# EAGLE design microcpu-1line-try1 (EAGLE 9.6.2)

## Sheet 1 of 2
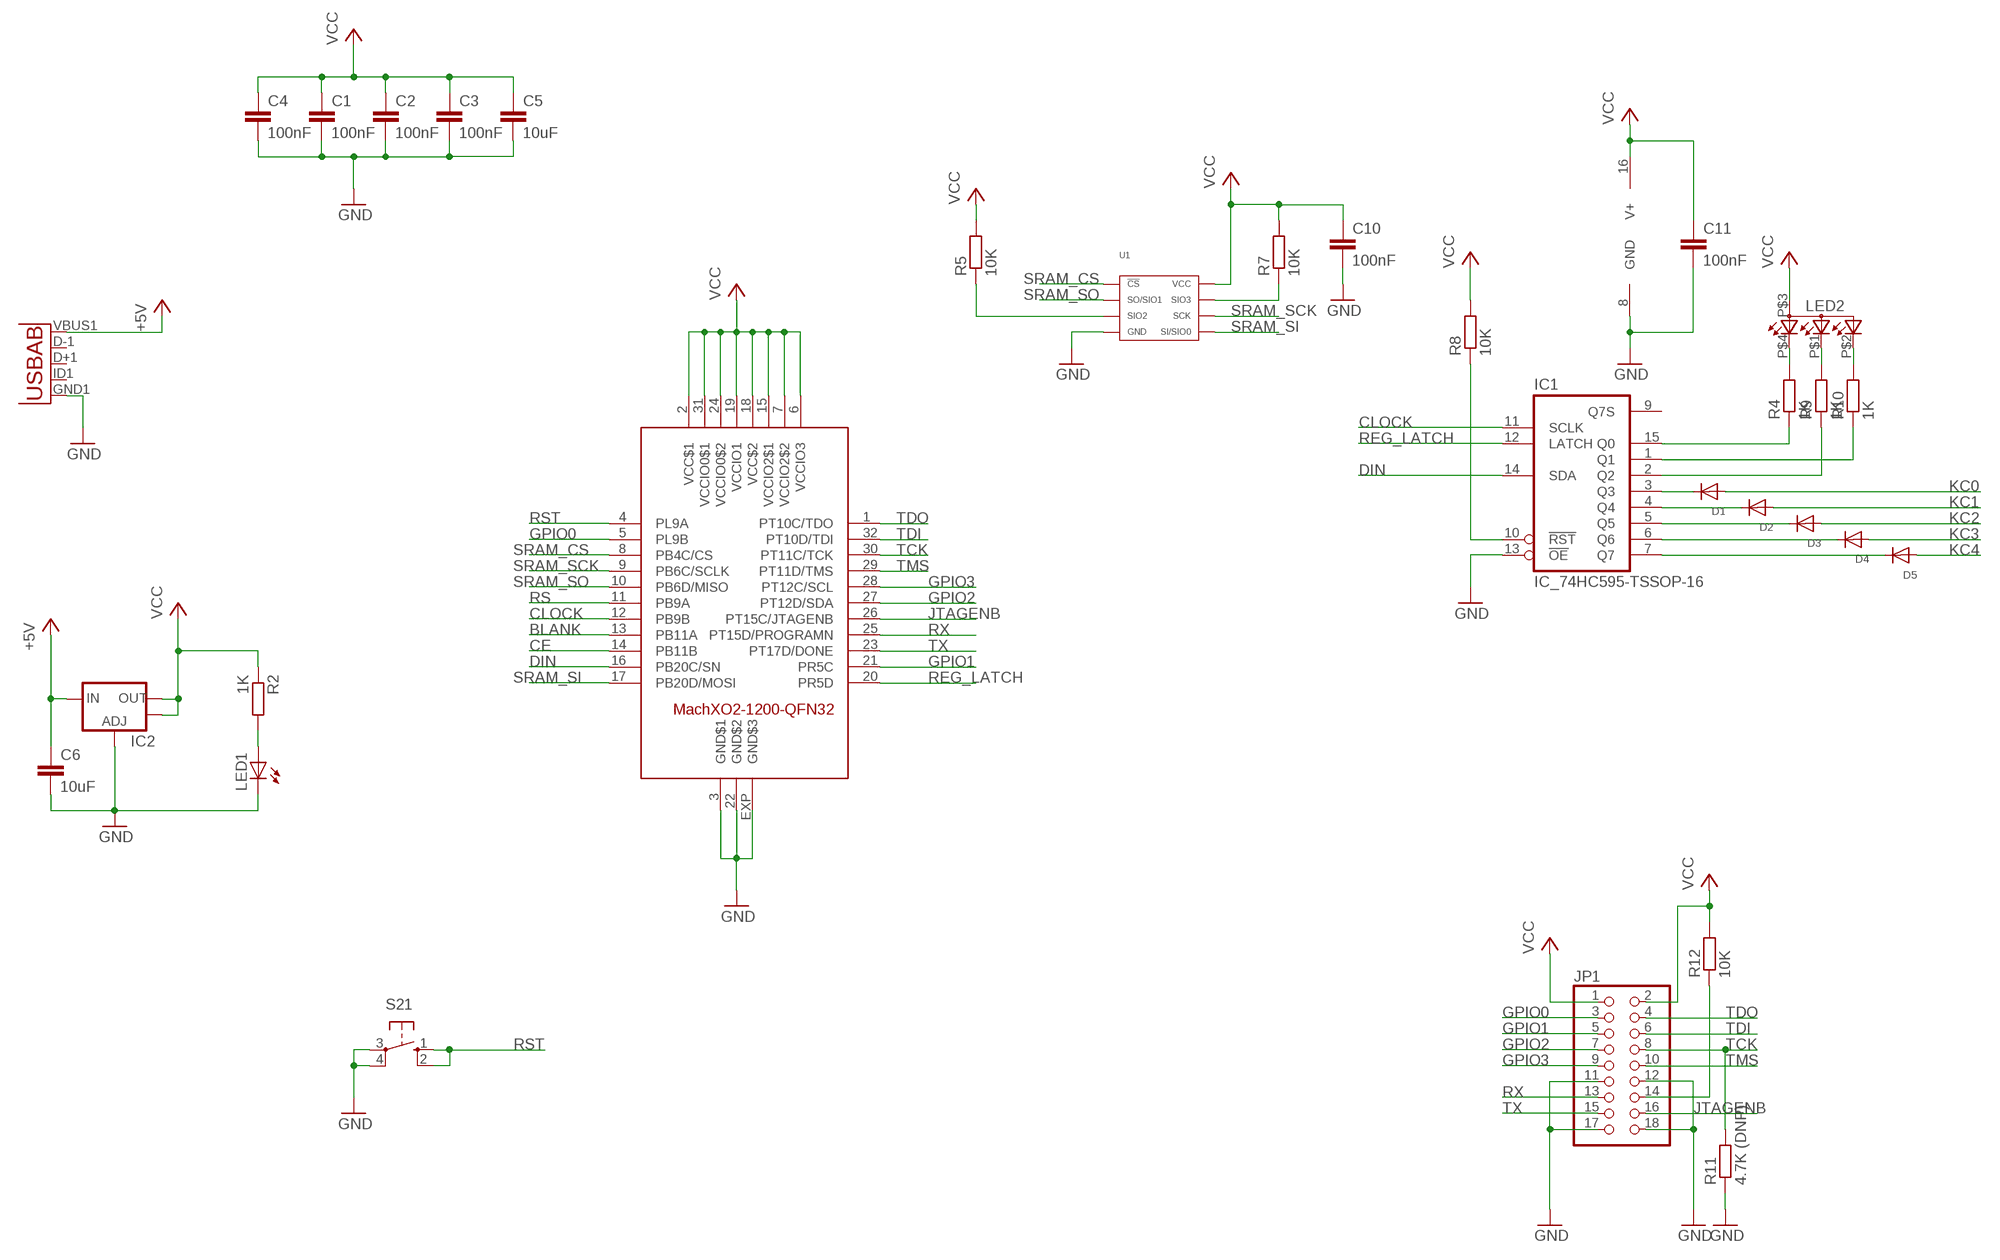
[diagram p0: schematic, sheet 1]

### Parts
C1  100nF  C-EUC0603  [C0603]
C2  100nF  C-EUC0603  [C0603]
C3  100nF  C-EUC0603  [C0603]
C4  100nF  C-EUC0603  [C0603]
C5  10uF  C-EUC0805  [C0805]
C6  10uF  C-EUC0805  [C0805]
C10  100nF  C-EUC0603  [C0603]
C11  100nF  C-EUC0603  [C0603]
D1  DIODESOD-123  [SOD-123]
D2  DIODESOD-123  [SOD-123]
D3  DIODESOD-123  [SOD-123]
D4  DIODESOD-123  [SOD-123]
D5  DIODESOD-123  [SOD-123]
IC1  IC_74HC595-TSSOP-16  [TSSOP-16]
IC2  V_REG_LM1117SOT223  [SOT223]
JP1  PINHD-2X9/90  [2X09/90]
LED1  LEDCHIPLED_0603  [CHIPLED_0603]
LED2  19-237/R6GHBHC-A04/2T  [19-237/R6GHBHC-A04/2T]
R2  1K  R-EU_R0603  [R0603]
R4  1K  R-EU_R0603  [R0603]
R5  10K  R-EU_R0603  [R0603]
R7  10K  R-EU_R0603  [R0603]
R8  10K  R-EU_R0603  [R0603]
R9  1K  R-EU_R0603  [R0603]
R10  1K  R-EU_R0603  [R0603]
R11  4.7K (DNP)  R-EU_R0603  [R0603]
R12  10K  R-EU_R0603  [R0603]
S21  10-XX  [B3F-10XX]
U1  23A1024/23LC1024-I/SN  [23A1024_SOIC-8]
U2  USB""  [USB-MICRO-SMD]
U$1  MACHXO2-1200  [QFN32]

### Nets
+5V: C6.1 IC2.3(IN) U2.VBUS1(VBUS)
BLANK: U$1.13(PB11A) ; also sheet 2
CE: U$1.14(PB11B) ; also sheet 2
CLOCK: IC1.11(SCLK) U$1.12(PB9B) ; also sheet 2
DIN: IC1.14(SDA) U$1.16(PB20C/SN) ; also sheet 2
GND [POWER]: C1.2 C2.2 C3.2 C4.2 C5.2 C6.2 C10.2 C11.2 IC1.8(GND) IC1.13(!OE) IC2.1(ADJ) JP1.11 JP1.12 JP1.17 JP1.18 LED1.C R11.1 S21.3(P) S21.4(P1) U1.4(GND) U2.GND1(GND) U$1.3(GND$1) U$1.22(GND$2) U$1.EXP(GND$3) ; also sheet 2
GPIO0: JP1.3 U$1.5(PL9B)
GPIO1: JP1.5 U$1.21(PR5C)
GPIO2: JP1.7 U$1.27(PT12D/SDA)
GPIO3: JP1.9 U$1.28(PT12C/SCL)
JTAGENB: JP1.16 U$1.26(PT15C/JTAGENB)
KC0: D1.A ; also sheet 2
KC1: D2.A ; also sheet 2
KC2: D3.A ; also sheet 2
KC3: D4.A ; also sheet 2
KC4: D5.A ; also sheet 2
N$1: LED1.A R2.2
N$3: R7.1 U1.7(SIO3)
N$4: IC1.10(!RST) R8.1
N$5: R5.1 U1.3(SIO2)
N$6: LED2.P$4(CRED) R4.2
N$7: LED2.P$1(CBLUE) R9.2
N$8: LED2.P$2(CGREEN) R10.2
N$9: IC1.15(Q0) R4.1
N$10: IC1.1(Q1) R10.1
N$11: IC1.2(Q2) R9.1
N$12: JP1.14 R12.1
N$13: D1.C IC1.3(Q3)
N$14: D2.C IC1.4(Q4)
N$15: D3.C IC1.5(Q5)
N$16: D4.C IC1.6(Q6)
N$17: D5.C IC1.7(Q7)
REG_LATCH: IC1.12(LATCH) U$1.20(PR5D)
RS: U$1.11(PB9A) ; also sheet 2
RST: S21.1(S) S21.2(S1) U$1.4(PL9A)
RX: JP1.13 U$1.25(PT15D/PROGRAMN)
SRAM_CS: U1.1(CS') U$1.8(PB4C/CS)
SRAM_SCK: U1.6(SCK) U$1.9(PB6C/SCLK)
SRAM_SI: U1.5(SI/SIO0) U$1.17(PB20D/MOSI)
SRAM_SO: U1.2(SO/SIO1) U$1.10(PB6D/MISO)
TCK: JP1.8 R11.2 U$1.30(PT11C/TCK) ; also sheet 2
TDI: JP1.6 U$1.32(PT10D/TDI) ; also sheet 2
TDO: JP1.4 U$1.1(PT10C/TDO) ; also sheet 2
TMS: JP1.10 U$1.29(PT11D/TMS) ; also sheet 2
TX: JP1.15 U$1.23(PT17D/DONE)
VCC [POWER]: C1.1 C2.1 C3.1 C4.1 C5.1 C10.1 C11.1 IC1.16(V+) IC2.2(OUT) IC2.4(OUT) JP1.1 JP1.2 LED2.P$3(A) R2.1 R5.2 R7.2 R8.2 R12.2 U1.8(VCC) U$1.2(VCC$1) U$1.6(VCCIO3) U$1.7(VCCIO2$2) U$1.15(VCCIO2$1) U$1.18(VCC$2) U$1.19(VCCIO1) U$1.24(VCCIO0$2) U$1.31(VCCIO0$1) ; also sheet 2
Unconnected: IC1.9(Q7S) U2.D+1(D+) U2.D-1(D-) U2.ID1(USBID)

## Sheet 2 of 2
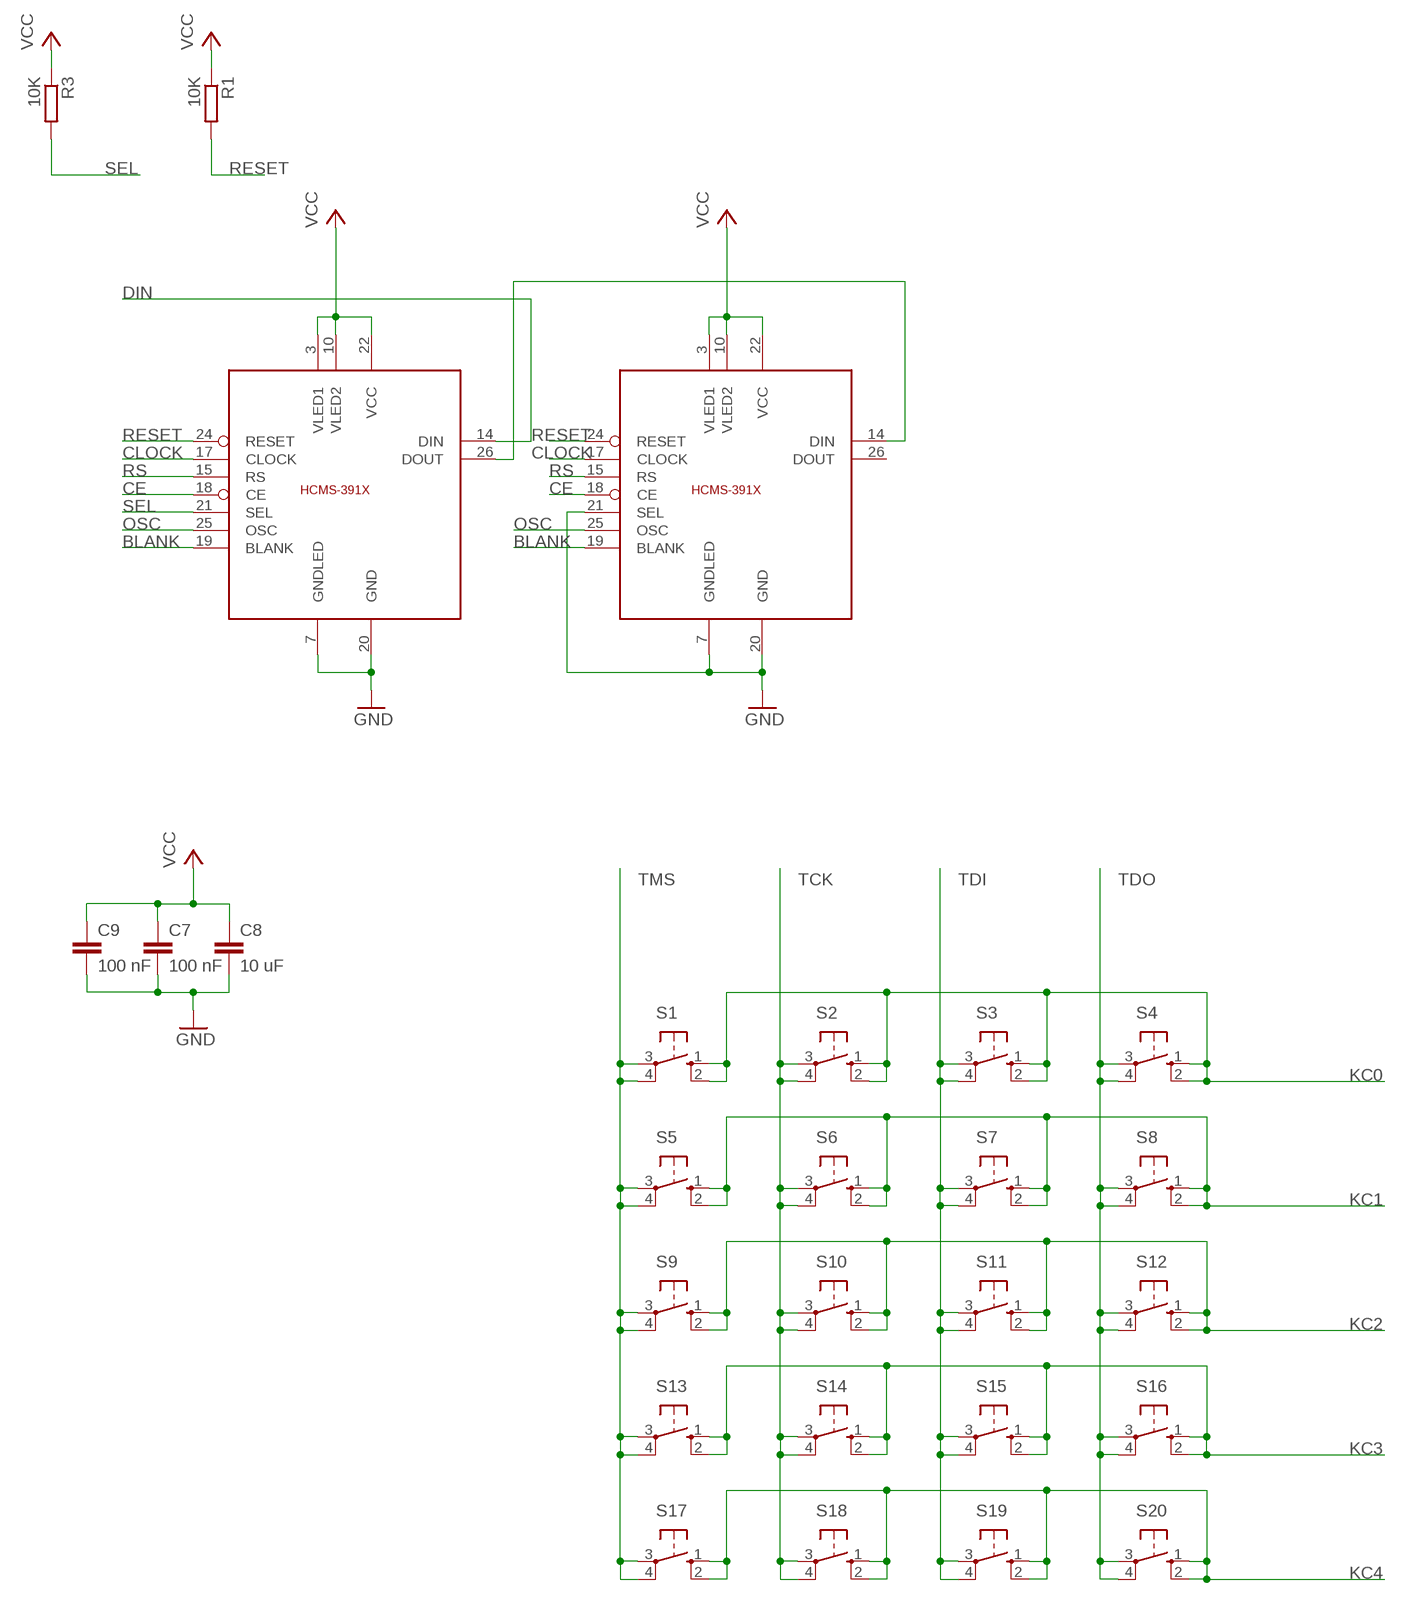
[diagram p1: schematic, sheet 2]

### Parts
C7  100 nF  C-EUC0603K  [C0603K]
C8  10 uF  C-EUC0805K  [C0805K]
C9  100 nF  C-EUC0603K  [C0603K]
R1  10K  R-EU_R0603  [R0603]
R3  10K  R-EU_R0603  [R0603]
S1  10-XX  [B3F-10XX]
S2  10-XX  [B3F-10XX]
S3  10-XX  [B3F-10XX]
S4  10-XX  [B3F-10XX]
S5  10-XX  [B3F-10XX]
S6  10-XX  [B3F-10XX]
S7  10-XX  [B3F-10XX]
S8  10-XX  [B3F-10XX]
S9  10-XX  [B3F-10XX]
S10  10-XX  [B3F-10XX]
S11  10-XX  [B3F-10XX]
S12  10-XX  [B3F-10XX]
S13  10-XX  [B3F-10XX]
S14  10-XX  [B3F-10XX]
S15  10-XX  [B3F-10XX]
S16  10-XX  [B3F-10XX]
S17  10-XX  [B3F-10XX]
S18  10-XX  [B3F-10XX]
S19  10-XX  [B3F-10XX]
S20  10-XX  [B3F-10XX]
U$2  HCMS-391X  [HCMS-391X]
U$3  HCMS-391X  [HCMS-391X]

### Nets
BLANK: U$2.19(BLANK) U$3.19(BLANK) ; also sheet 1
CE: U$2.18(CE) U$3.18(CE) ; also sheet 1
CLOCK: U$2.17(CLOCK) U$3.17(CLOCK) ; also sheet 1
DIN: U$2.14(DIN) ; also sheet 1
GND [POWER]: C7.2 C8.2 C9.2 U$2.7(GNDLED) U$2.20(GND) U$3.7(GNDLED) U$3.20(GND) U$3.21(SEL) ; also sheet 1
KC0: S1.1(S) S1.2(S1) S2.1(S) S2.2(S1) S3.1(S) S3.2(S1) S4.1(S) S4.2(S1) ; also sheet 1
KC1: S5.1(S) S5.2(S1) S6.1(S) S6.2(S1) S7.1(S) S7.2(S1) S8.1(S) S8.2(S1) ; also sheet 1
KC2: S9.1(S) S9.2(S1) S10.1(S) S10.2(S1) S11.1(S) S11.2(S1) S12.1(S) S12.2(S1) ; also sheet 1
KC3: S13.1(S) S13.2(S1) S14.1(S) S14.2(S1) S15.1(S) S15.2(S1) S16.1(S) S16.2(S1) ; also sheet 1
KC4: S17.1(S) S17.2(S1) S18.1(S) S18.2(S1) S19.1(S) S19.2(S1) S20.1(S) S20.2(S1) ; also sheet 1
N$2: U$2.26(DOUT) U$3.14(DIN)
OSC: U$2.25(OSC) U$3.25(OSC)
RESET: R1.2 U$2.24(RESET) U$3.24(RESET)
RS: U$2.15(RS) U$3.15(RS) ; also sheet 1
SEL: R3.2 U$2.21(SEL)
TCK: S2.3(P) S2.4(P1) S6.3(P) S6.4(P1) S10.3(P) S10.4(P1) S14.3(P) S14.4(P1) S18.3(P) S18.4(P1) ; also sheet 1
TDI: S3.3(P) S3.4(P1) S7.3(P) S7.4(P1) S11.3(P) S11.4(P1) S15.3(P) S15.4(P1) S19.3(P) S19.4(P1) ; also sheet 1
TDO: S4.3(P) S4.4(P1) S8.3(P) S8.4(P1) S12.3(P) S12.4(P1) S16.3(P) S16.4(P1) S20.3(P) S20.4(P1) ; also sheet 1
TMS: S1.3(P) S1.4(P1) S5.3(P) S5.4(P1) S9.3(P) S9.4(P1) S13.3(P) S13.4(P1) S17.3(P) S17.4(P1) ; also sheet 1
VCC [POWER]: C7.1 C8.1 C9.1 R1.1 R3.1 U$2.3(VLED1) U$2.10(VLED2) U$2.22(VCC) U$3.3(VLED1) U$3.10(VLED2) U$3.22(VCC) ; also sheet 1
Unconnected: U$3.26(DOUT)

## Library data of the parts
C1-C7 C9-C11 = resistor:C-EU: CAPACITOR, European symbol
C8 = rcl:C-EU: CAPACITOR, European symbol
D1-D5 = adafruit:DIODE: Diode SMADIODE - SMA Surface Mount Package 20V 1A Schottky Diode Digikey: 641-1014-6-ND DO-1N4148 - Through Hole Small Current Diode SOD-123 20V 1 A (.5mV Vf) Schottky Diode - Digikey: MBRX120TPMSCT-ND SOD-323 10V 570mA (.38mV Vf, 3ns) Schottky Diode - Digikey: ZLLS410CT-ND SOD-523 30V 30mA Schottky Diode (RB751S-40TE61) - Digikey: RB751S-40TE61CT-ND SOT23-R/W - SOT23 Package (R = Solder Paste/Reflow Ovens, W = Hand-Soldering) BAT54Film 40V 300mA - Digikey: 497-7162-1-ND
IC1 = dp_devices:IC_74HC595: 8-bit serial-in parallel out shift register, output latch 3-state
IC2 = SparkFun:V_REG_LM1117: Voltage Regulator LM1117 Standard adjustable voltage regulator but in SMD form. Spark Fun Electronics SKU : COM-00595
JP1 = pinhead:PINHD-2X9: PIN HEADER
LED1 = led:LED: LED OSRAM: - CHIPLED LG R971, LG N971, LY N971, LG Q971, LY Q971, LO R971, LY R971 LH N974, LH R974 LS Q976, LO Q976, LY Q976 LO Q996 - Hyper CHIPLED LW Q18S LB Q993, LB Q99A, LB R99A - SideLED LS A670, LO A670, LY A670, LG A670, LP A670 LB A673, LV A673, LT A673, LW A673 LH A674 LY A675 LS A676, LA A676, LO A676, LY A676, LW A676 LS A679, LY A679, LG A679 - Hyper Micro SIDELED® LS Y876, LA Y876, LO Y876, LY Y876 LT Y87S - SmartLED LW L88C, LW L88S LB L89C, LB L89S, LG L890 LS L89K, LO L89K, LY L89K LS L896, LA L896, LO L896, LY L896 - TOPLED LS T670, LO T670, LY T670, LG T670, LP T670 LSG T670, LSP T670, LSY T670, LOP T670, LYG T670 LG T671, LOG T671, LSG T671 LB T673, LV T673, LT T673, LW T673 LH T674 LS T676, LA T676, LO T676, LY T676, LB T676, LH T676, LSB T676, LW T676 LB T67C, LV T67C, LT T67C, LS T67K, LO T67K, LY T67K, LW E67C LS E67B, LA E67B, LO E67B, LY E67B, LB E67C, LV E67C, LT E67C LW T67C LS T679, LY T679, LG T679 LS T770, LO T770, LY T770, LG T770, LP T770 LB T773, LV T773, LT T773, LW T773 LH T774 LS E675, LA E675, LY E675, LS T675 LS T776, LA T776, LO T776, LY T776, LB T776 LHGB T686 LT T68C, LB T68C - Hyper Mini TOPLED® LB M676 - Mini TOPLED Santana® LG M470 LS M47K, LO M47K, LY M47K Source: http://www.osram.convergy.de LUXEON: - LUMILED® LXK2-PW12-R00, LXK2-PW12-S00, LXK2-PW14-U00, LXK2-PW14-V00 LXK2-PM12-R00, LXK2-PM12-S00, LXK2-PM14-U00 LXK2-PE12-Q00, LXK2-PE12-R00, LXK2-PE12-S00, LXK2-PE14-T00, LXK2-PE14-U00 LXK2-PB12-K00, LXK2-PB12-L00, LXK2-PB12-M00, LXK2-PB14-N00, LXK2-PB14-P00, LXK2-PB14-Q00 LXK2-PR12-L00, LXK2-PR12-M00, LXK2-PR14-Q00, LXK2-PR14-R00 LXK2-PD12-Q00, LXK2-PD12-R00, LXK2-PD12-S00 LXK2-PH12-R00, LXK2-PH12-S00 LXK2-PL12-P00, LXK2-PL12-Q00, LXK2-PL12-R00 Source: www.luxeon.com KINGBRIGHT: KA-3528ASYC Source: www.kingbright.com
LED2 = mouse_enc:19-237/R6GHBHC-A04/2T
R1-R5 R7-R12 = resistor:R-EU_: RESISTOR, European symbol
S1-S21 = switch-omron:10-XX: OMRON SWITCH; MPN: B3F-1000; OC_FARNELL: 176432; OC_NEWARK: 36M3542
U1 = stepfpga:23A1024/23LC1024: Manufacturer Part #: 23A1024/23LC1024 Manufacturer: Microchip Technology Description: SRAM 1024K 1.8V SPI SERIAL SRAM SQI
U2 = MicroUSB:USB: This is a USB AB connector that is compatible with USB OTG. i.e. this connector can serve as a host or device
U$1 = addons-lib:MACHXO2-1200
U$2 U$3 = HCMS-391X:HCMS-391X

## Net classes
0 default: width 0.152 mm, clearance 0.205 mm
1 POWER: width 0.203 mm

## Board
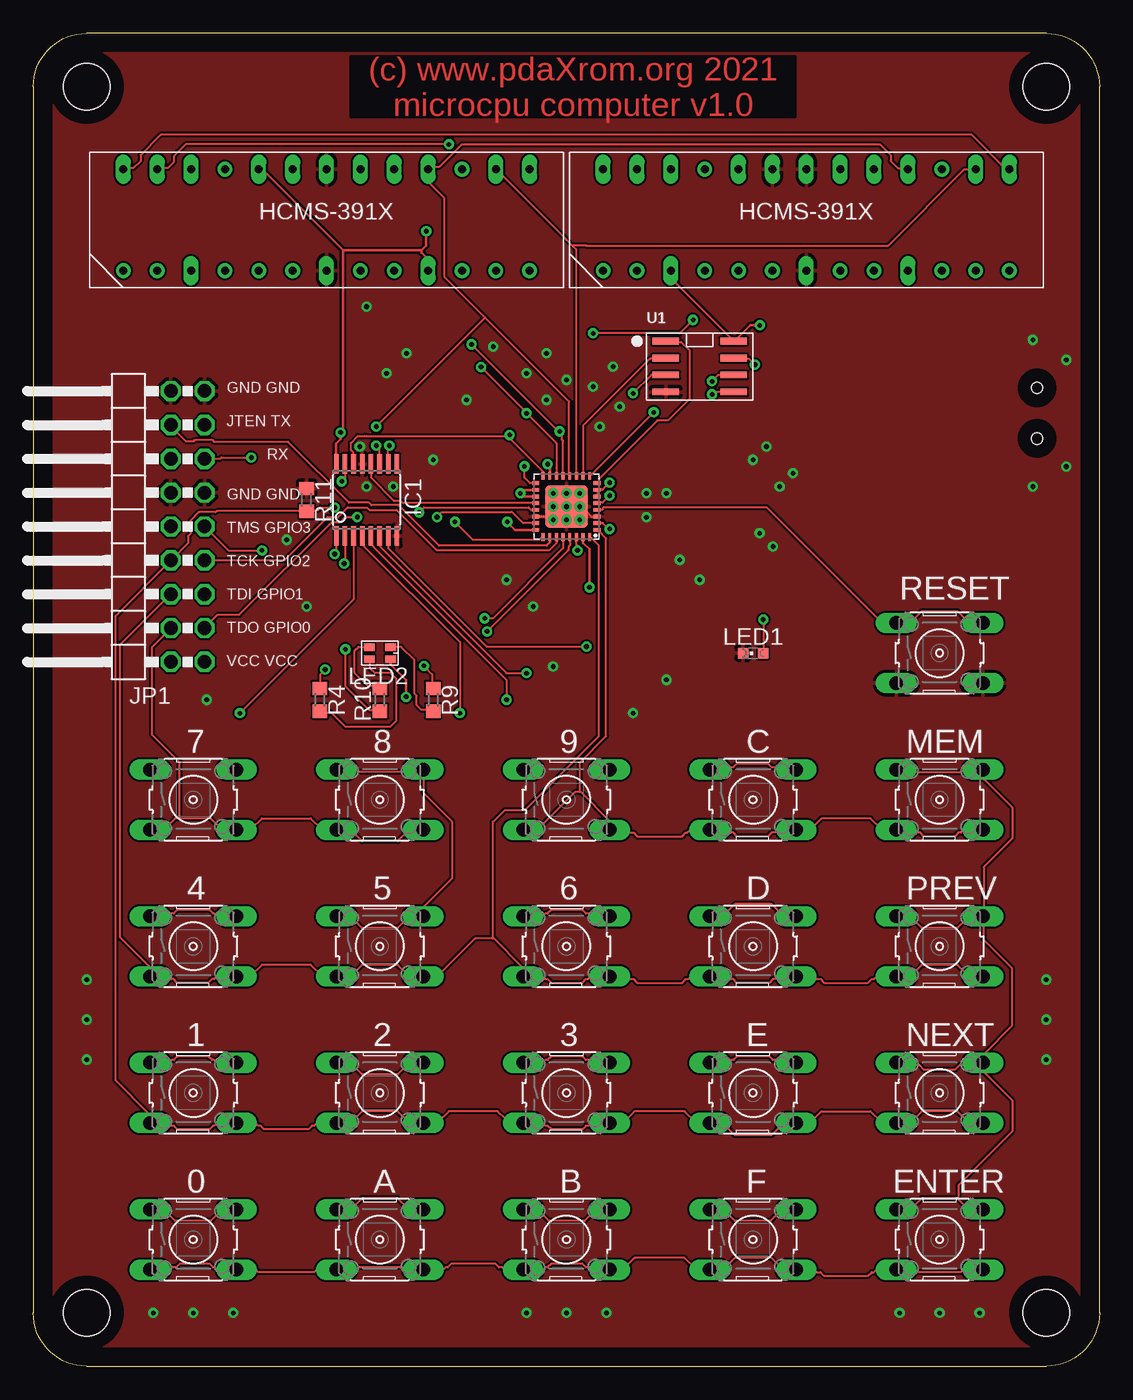
[diagram p2: board, top side]
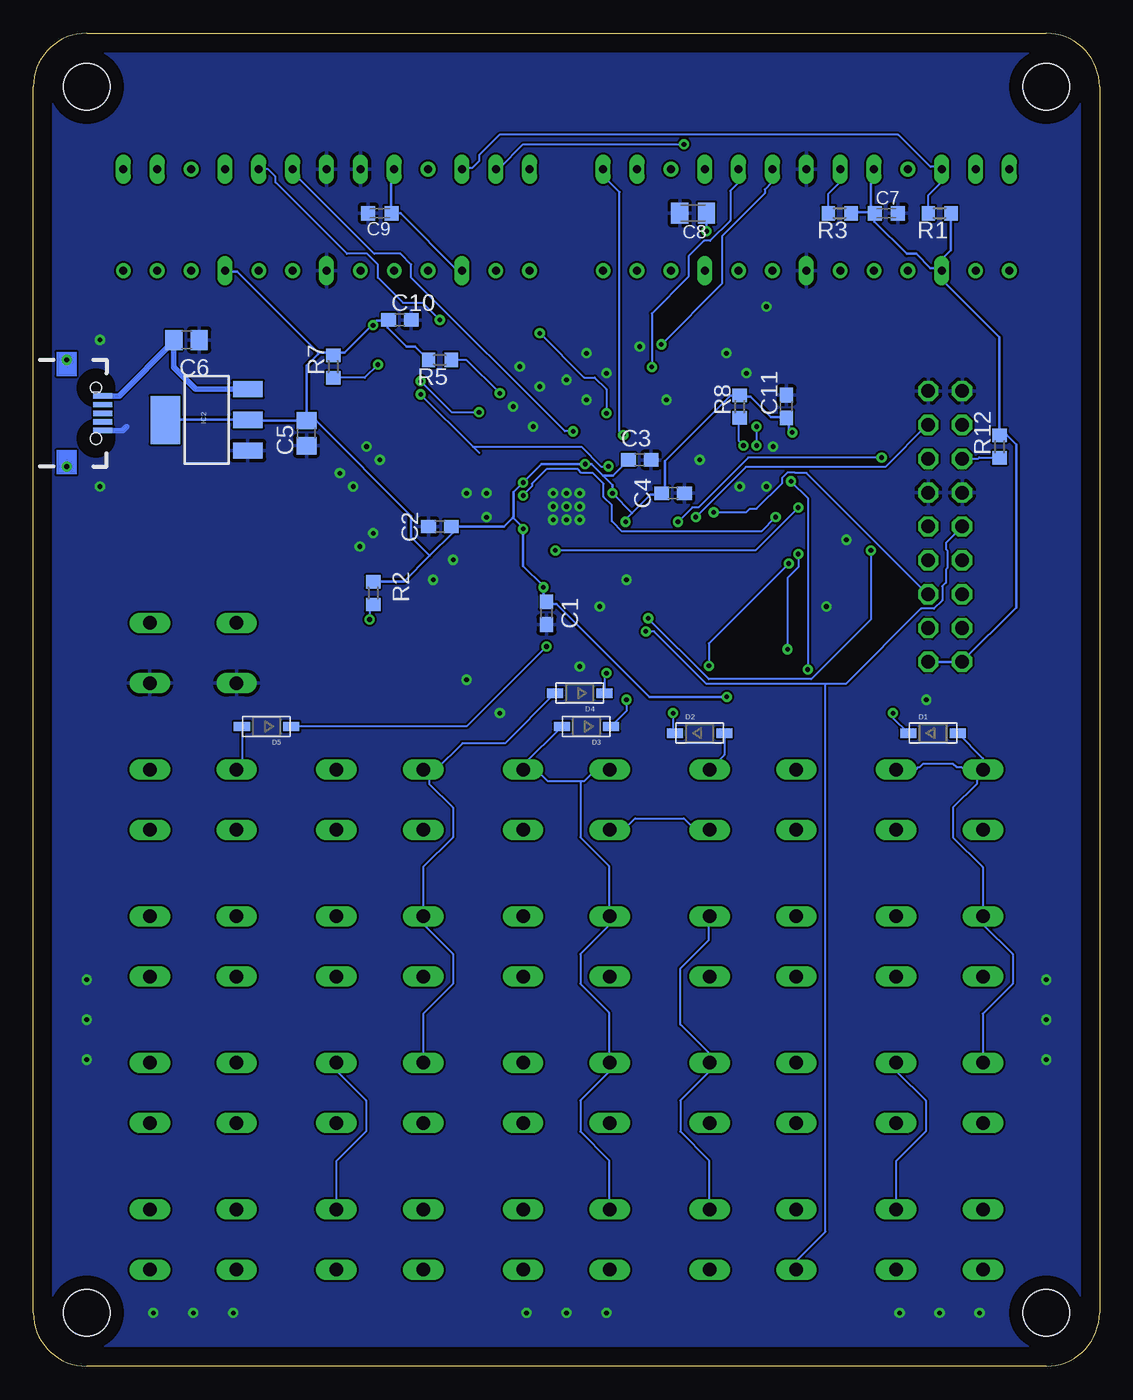
[diagram p3: board, bottom side, seen from below]

Size 80 x 100 mm. Coordinates in mm from the lower left corner, seen from the top.
Outline: 76,100 4,100 arc90 0,96 0,4 arc90 4,0 76,0 arc90 80,4 80,96 arc90 76,100
Copper layers (1*16): Top 0.035mm / dielectric 1.5mm / Bottom 0.035mm
Design rules "default *": minimum track width 6mil, minimum drill 0.35mm, track to track 6mil, track to pad 6mil, pad to pad 6mil, via to via 6mil, smd to smd 6mil, copper to edge 40mil, drill to drill 6mil, minimum pad ring 10mil, minimum via ring 8mil, stop-mask expansion 4mil, vias tented up to drill 23mil, thermal gap 10mil
Holes 3.5 mm at 4,4 76,4 76,96 4,96

### Footprints (pad centres in the part's own frame; a part is rotated, then mirrored left to right if it is on the bottom)
C0603 = smd 1.1 x 1: 1 -0.85,0; 2 0.85,0
C0805 = smd 1.3 x 1.5: 1 -0.95,0; 2 0.95,0
C0603K = smd 1.05 x 1.08: 1 -0.875,0; 2 0.875,0
C0805K = smd 1.3 x 1.6: 1 -1,0; 2 1,0
SOD-123 = smd 1.2 x 0.7: A 1.85,0; C -1.85,0
TSSOP-16 = smd 0.35 x 1.43: 1 -2.275,-2.7; 2 -1.625,-2.7; 3 -0.975,-2.7; 4 -0.325,-2.7; 5 0.325,-2.7; 6 0.975,-2.7; 7 1.625,-2.7; 8 2.275,-2.7; 9 2.275,2.7; 10 1.625,2.7; 11 0.975,2.7; 12 0.325,2.7; 13 -0.325,2.7; 14 -0.975,2.7; 15 -1.625,2.7; 16 -2.275,2.7
SOT223 = smd 1.219 x 2.235: 1 -2.311,-3.099; 2 0,-3.099; 3 2.311,-3.099 | smd 3.6 x 2.2: 4 0,3.099
2X09/90 = drill 1.016 octagon: 1 -10.16,-6.35; 2 -10.16,-3.81; 3 -7.62,-6.35; 4 -7.62,-3.81; 5 -5.08,-6.35; 6 -5.08,-3.81; 7 -2.54,-6.35; 8 -2.54,-3.81; 9 0,-6.35; 10 0,-3.81; 11 2.54,-6.35; 12 2.54,-3.81; 13 5.08,-6.35; 14 5.08,-3.81; 15 7.62,-6.35; 16 7.62,-3.81; 17 10.16,-6.35; 18 10.16,-3.81
CHIPLED_0603 = smd 0.8 x 0.8: A 0,-0.75; C 0,0.75
19-237/R6GHBHC-A04/2T = smd 0.55 x 0.8: P$1 0.45,-0.8; P$2 0.45,0.8; P$3 -0.45,-0.8; P$4 -0.45,0.8
R0603 = smd 1 x 1.1: 1 -0.85,0; 2 0.85,0
B3F-10XX = drill 1.016 long: 1 -3.251,2.261; 2 3.251,2.261; 3 -3.251,-2.261; 4 3.251,-2.261
23A1024_SOIC-8 = smd 2 x 0.5: 1 -2.55,1.905; 2 -2.55,0.635; 3 -2.55,-0.635; 4 -2.55,-1.905; 5 2.55,-1.905; 6 2.55,-0.635; 7 2.55,0.635; 8 2.55,1.905
USB-MICRO-SMD = smd 1.4 x 0.4: D+1 2.7,0; D-1 2.7,0.65; GND1 2.7,-1.3; ID1 2.7,-0.65; VBUS1 2.7,1.3 | hole 0.85: 2.2,1.9; 2.2,-1.9
QFN32 = smd 0.6 x 0.3: 1 -2.3,1.75; 2 -2.3,1.25; 3 -2.3,0.75; 4 -2.3,0.25; 5 -2.3,-0.25; 6 -2.3,-0.75; 7 -2.3,-1.25; 8 -2.3,-1.75; 17 2.3,-1.75; 18 2.3,-1.25; 19 2.3,-0.75; 20 2.3,-0.25; 21 2.3,0.25; 22 2.3,0.75; 23 2.3,1.25; 24 2.3,1.75 | smd 0.3 x 0.6: 9 -1.75,-2.3; 10 -1.25,-2.3; 11 -0.75,-2.3; 12 -0.25,-2.3; 13 0.25,-2.3; 14 0.75,-2.3; 15 1.25,-2.3; 16 1.75,-2.3; 25 1.75,2.3; 26 1.25,2.3; 27 0.75,2.3; 28 0.25,2.3; 29 -0.25,2.3; 30 -0.75,2.3; 31 -1.25,2.3; 32 -1.75,2.3 | smd 3.2 x 3.2: EXP 0,0
HCMS-391X = drill 0.6 long: 3 -10.16,-3.81; 7 0,-3.81; 10 7.62,-3.81; 14 15.24,3.81; 15 12.7,3.81; 17 7.62,3.81; 18 5.08,3.81; 19 2.54,3.81; 20 0,3.81; 21 -2.54,3.81; 22 -5.08,3.81; 24 -10.16,3.81; 25 -12.7,3.81; 26 -15.24,3.81 | drill 0.6: P$1 -15.24,-3.81; P$2 -12.7,-3.81; P$3 -7.62,3.81; P$4 -7.62,-3.81; P$5 -5.08,-3.81; P$6 -2.54,-3.81; P$7 2.54,-3.81; P$8 5.08,-3.81; P$9 10.16,-3.81; P$10 12.7,-3.81; P$11 15.24,-3.81; P$12 10.16,3.81

### Placement (x,y rotation side)
C1  41.5,56.5 270 bottom
C2  49.5,63 180 bottom
C3  34.5,68 0 bottom
C4  32,65.5 0 bottom
C5  59.5,70 270 bottom
C6  68.5,77 0 bottom
C7  16,86.5 0 bottom
C8  30.5,86.5 180 bottom
C9  54,86.5 180 bottom
C10  52.5,78.5 0 bottom
C11  23.5,72 90 bottom
D1  12.5,47.5 0 bottom
D2  30,47.5 0 bottom
D3  38.5,48 180 bottom
D4  39,50.5 180 bottom
D5  62.5,48 180 bottom
IC1  25,65 0 top
IC2  67,71 90 bottom
JP1  6.5,63 90 top
LED1  54,53.5 90 top
LED2  26,53.5 90 top
R1  12,86.5 180 bottom
R2  54.5,58 270 bottom
R3  19.5,86.5 180 bottom
R4  21.5,50 270 top
R5  49.5,75.5 180 bottom
R7  57.5,75 90 bottom
R8  27,72 90 bottom
R9  30,50 270 top
R10  26,50 90 top
R11  20.5,65 270 top
R12  7.5,69 90 bottom
S1  12,9.5 0 top
S2  12,20.5 0 top
S3  12,31.5 0 top
S4  12,42.5 0 top
S5  26,9.5 0 top
S6  26,20.5 0 top
S7  26,31.5 0 top
S8  26,42.5 0 top
S9  40,9.5 0 top
S10  40,20.5 0 top
S11  40,31.5 0 top
S12  40,42.5 0 top
S13  54,9.5 0 top
S14  54,20.5 0 top
S15  54,31.5 0 top
S16  54,42.5 0 top
S17  68,9.5 0 top
S18  68,20.5 0 top
S19  68,31.5 0 top
S20  68,42.5 0 top
S21  68,53.5 0 top
U1  50,75 0 top
U2  77.5,71.5 0 bottom
U$1  40,64.5 180 top
U$2  22,86 0 top
U$3  58,86 0 top

### Tracks (layer width: path | path; a pad name or v marks a point on that pad's centre or on a via)
+5V
  Bottom 0.152: 69.42,76.93 C6.1
  Bottom 0.406: U2.VBUS1 73.56,72.8 69.42,76.93 | IC2.3 67.81,73.31 69.45,74.95 C6.1
BLANK  (via drill 0.35)
  Top 0.152: v32.88,76.66 39.45,70.09 | 39.45,70.09 39.67,69.87 39.67,69.5 39.75,69.42 U$1.13 | v39.49,70.14 39.45,70.09
  Bottom 0.152: v32.88,76.66 28.32,81.22 28.32,84.79 25.11,88.01 25.11,88.28 24.57,88.81 24.57,89.8 U$2.19 | v39.49,70.14 40.12,70.14 51.64,81.67 51.64,82.65 52.45,83.45 54.41,83.45 60.49,89.53 60.49,89.8 U$3.19
CE  (via drill 0.35)
  Top 0.152: v49.5,78.5 48.5,77.5 v42,77.5 | v33.6,74.97 37,71.56 v37,71.5 39.25,69.25 39.25,67.41 U$1.14
  Bottom 0.152: v33.6,74.97 33.6,78.98 30.83,81.75 30.83,83.27 29.66,84.44 29.22,84.44 27.7,85.95 27.7,88.19 27.16,88.72 27.16,89.8 U$2.18 | U$3.18 62.99,89.8 62.37,89.8 61.83,89.26 61.83,88.81 56.47,83.45 54.95,83.45 54.15,82.65 54.15,81.67 52.27,79.79 50.79,79.79 v49.5,78.5 | v42,77.5 38.68,74.18 37.88,74.18 37,73.3 v37,71.5
CLOCK  (via drill 0.35)
  Top 0.152: 33.91,78.67 30.83,81.75 30.83,87.65 29.66,88.81 29.66,89.8 U$2.17 29.66,89.89 29.75,89.97 30.47,89.97 32.17,91.67 63.53,91.67 64.33,90.87 64.33,90.42 64.87,89.89 65.58,89.89 U$3.17 | 33.91,78.67 40.21,72.37 40.21,66.84 U$1.12 | 33.91,78.67 v25.73,70.5 | IC1.11 25.98,68.83 v25.73,69.07
  Bottom 0.152: v25.73,70.5 v25.73,69.07
DIN  (via drill 0.35)
  Top 0.152: 35.61,69.74 35.56,69.78 25,69.78 24.84,69.78 24.35,69.78 23.84,69.27 23.84,68.73 24.02,68.54 IC1.14 | 35.61,69.74 38.24,67.1 38.24,66.83 U$1.16 | 35.61,69.74 v35.74,69.87
  Bottom 0.152: v35.74,69.87 36.01,70.14 36.01,88.1 37.17,89.26 37.17,89.8 U$2.14
GND  (via drill 0.35)
  Top 0.203: 40.03,64.42 41.19,64.42 41.91,63.71 42.26,63.71 U$1.3 | 40.03,64.42 U$1.EXP | U$1.22 39.36,63.75 40.03,64.42
  Bottom 0.406: U2.GND1 73.3,70.2 73,70.5
  other vias: 30,68 35.5,59 37.5,57 39,52.5 45,49 47.5,51.5 25,66 27,66 32.5,72.5 13,50 20.5,57 19,62 24.5,69 40,64.5 39,65.5 40,65.5 41,65.5 41,64.5 39,64.5 39,63.5 40,63.5 41,63.5 46,65.5 47.5,65.5 46,63.7 48.5,60.5 50,59 55.5,61.5 54.5,62.5 56,66 57,67 55,69 54,68 34.5,76.5 37,74.5 38.5,72.5 40,74 38.5,76 42,73.5 43.5,75 42.5,70.5 44,72 25,79.5 26.5,74.5 28,76 37,4 40,4 43,4 9,4 12,4 15,4 65,4 68,4 71,4 4,29 4,26 4,23 76,29 76,26 76,23 75,77 75,66 77.5,75.5 77.5,67.5
  pour Top: 1.5,96.5 1.5,3.5 arc90 3.5,1.5 76.5,1.5 arc90 78.5,3.5 78.5,96.5 arc90 76.5,98.5 3.5,98.5 arc90
  pour Bottom: 1.5,96.5 1.5,3.5 arc90 3.5,1.5 76.5,1.5 arc90 78.5,3.5 78.5,96.5 arc90 76.5,98.5 3.5,98.5 arc90
GPIO0  (via drill 0.35)
  Top 0.152: v43.24,65.31 42.71,64.78 42.35,64.78 U$1.5 | v24.3,63.71 23.41,63.71 23.05,63.35 22.43,63.35 15.46,56.38 13.85,56.38 12.87,55.4 JP1.3
  Bottom 0.152: v24.3,63.71 25.38,62.63 35.83,62.63 36.6,63.4 36.6,64.61 37.2,65.22 37.2,66.2 38.02,67.02 38.87,67.02 39.14,67.3 41.5,67.3 42.59,66.21 42.59,66.03 43.24,65.36 v43.24,65.31
GPIO1  (via drill 0.35)
  Top 0.152: v28.95,64.06 29.31,64.42 37.17,64.42 37.35,64.24 37.62,64.24 U$1.21
  Bottom 0.152: v28.95,64.06 26.5,64.06 26.22,64.34 25.73,64.34 23.8,66.27 23.8,66.66 23.73,66.73 23.41,67.05 | JP1.5 12.87,57.9 21.98,67.02 22.84,67.02 22.87,67.05 23.41,67.05 | 23.41,67.05
GPIO2
  Top 0.152: 23.59,64.42 23.58,64.42 | 23.58,64.42 22.87,63.71 22.07,63.71 18.85,60.49 12.87,60.49 JP1.7 | 23.58,64.42 25.05,64.42 25.23,64.24 27.25,64.24 30.29,61.2 38.69,61.2 39.25,61.77 U$1.27
GPIO3  (via drill 0.35)
  Top 0.152: v33.86,56.11 34.49,56.11 39.75,61.37 U$1.28 | v17.16,61.2 14.65,61.2 12.87,62.99 JP1.9
  Bottom 0.152: v33.86,56.11 29.31,51.55 21.62,51.55 17.16,56.02 v17.16,61.2
JTAGENB
  Top 0.152: JP1.16 10.28,70.59 11.44,69.42 12.06,69.42 12.15,69.51 13.4,69.51 13.58,69.34 19.12,69.34 23.68,64.78 25.19,64.78 25.38,64.6 27.4,64.6 30.44,61.56 38.51,61.56 38.75,61.8 U$1.26
KC0
  Top 0.152: S1.1 8.76,11.71 9.83,11.71 10.63,10.9 13.31,10.9 14.12,11.71 15.19,11.71 S1.2 | S2.1 8.76,22.78 10.19,22.78 10.37,22.96 10.54,22.96 10.81,23.23 13.13,23.23 13.4,22.96 13.58,22.96 13.76,22.78 15.19,22.78 S2.2 | S3.1 8.76,33.77 10.19,33.77 10.37,33.95 10.54,33.95 10.81,34.22 13.22,34.22 13.49,33.95 13.58,33.95 13.76,33.77 15.19,33.77 S3.2
  Bottom 0.152: S1.2 15.28,11.79 15.28,15.37 13.04,17.6 13.04,19.93 15.19,22.07 15.19,22.7 S2.2 | 9.2,44.76 10.19,44.76 10.37,44.94 10.72,44.94 10.99,45.21 13.22,45.21 13.49,44.94 13.58,44.94 13.76,44.76 15.19,44.76 S4.2 | 9.2,44.76 S4.1 | 9.2,44.76 9.2,43.69 10.99,41.91 10.99,39.67 8.76,37.44 8.76,33.77 S3.1 8.67,33.69 8.67,33.06 6.52,30.91 6.52,28.68 8.76,26.45 8.76,22.78 S2.1 | 9.2,44.76 S4.1 | D1.A 8.75,45.6 S4.1
KC1
  Top 0.152: S8.1 22.78,44.67 24.3,44.67 24.39,44.59 27.7,44.59 27.79,44.67 29.22,44.67 S8.2 29.31,44.67 29.31,42.98 31.45,40.83 31.45,36.63 29.31,34.49 29.31,33.77 S7.2 29.22,33.69 28.14,33.69 27.34,32.88 24.66,32.88 23.86,33.69 22.78,33.69 S7.1 | S5.1 22.78,11.79 23.86,11.79 24.66,12.6 27.34,12.6 28.14,11.79 29.22,11.79 S5.2 | S6.1 22.78,22.7 23.86,22.7 24.66,21.89 27.34,21.89 28.14,22.7 29.22,22.7 S6.2
  Bottom 0.152: S5.2 29.31,11.79 29.31,15.46 31.45,17.6 31.45,19.93 29.31,22.07 29.31,22.7 S6.2 29.31,22.78 29.31,23.5 31.45,25.64 31.45,29.84 29.31,31.99 29.31,33.69 S7.2 | D2.A 28.15,45.86 S8.2
KC2
  Top 0.152: S9.1 36.81,11.71 37.88,11.71 38.69,10.9 41.37,10.9 42.17,11.71 43.24,11.71 S9.2 | S10.1 36.81,22.78 38.24,22.78 38.42,22.96 38.6,22.96 38.87,23.23 41.19,23.23 41.46,22.96 41.73,22.96 41.91,22.78 43.24,22.78 S10.2 | S11.1 36.81,33.77 38.24,33.77 38.42,33.95 38.6,33.95 38.87,34.22 41.19,34.22 41.46,33.95 41.73,33.95 41.91,33.77 43.24,33.77 S11.2
  Bottom 0.152: S9.1 36.81,11.79 36.81,15.46 38.96,17.6 38.96,19.93 36.81,22.07 36.81,22.7 S10.1 36.81,22.78 36.81,26.54 38.96,28.68 38.96,30.91 36.81,33.06 36.81,33.69 S11.1 36.81,33.77 36.81,37.53 38.96,39.67 38.96,43.87 | 43.24,44.67 42.17,44.67 41.37,43.87 38.96,43.87 | 38.96,43.87 38.69,43.87 37.88,44.67 36.81,44.67 S12.1 | 43.24,44.67 S12.2 | D3.A 43.24,45.1 43.24,44.67
KC3
  Top 0.152: S13.1 50.75,11.71 51.82,11.71 52.63,10.9 55.31,10.9 56.11,11.71 57.18,11.71 S13.2 | S14.1 50.75,22.78 52.18,22.78 52.36,22.96 52.54,22.96 52.81,23.23 55.22,23.23 55.49,22.96 57.01,22.96 57.18,22.78 S14.2 | S15.1 50.75,33.77 51.73,33.77 52.63,34.67 55.4,34.67 56.29,33.77 57.18,33.77 S15.2 | S16.2 57.18,44.76 55.75,44.76 55.58,44.94 55.4,44.94 55.13,45.21 52.81,45.21 52.54,44.94 52.27,44.94 52.09,44.76 S16.1
  Bottom 0.152: S13.2 57.27,11.79 57.27,15.37 55.04,17.6 55.04,19.93 57.18,22.07 57.18,22.7 S14.2 | 50.3,44.76 50.66,44.76 S16.1 50.3,44.76 | 50.3,44.76 49.77,44.76 47.8,46.73 44.62,46.73 D4.A | 50.3,44.76 50.3,43.69 48.52,41.91 48.52,39.67 50.75,37.44 50.75,33.77 S15.1 50.66,33.69 50.66,33.06 48.52,30.91 48.52,28.68 50.75,26.45 50.75,22.78 S14.1
KC4
  Top 0.152: S19.1 64.78,33.69 65.85,33.69 66.66,32.88 69.34,32.88 70.14,33.69 71.21,33.69 S19.2 | 69.38,12.55 70.14,11.79 71.21,11.79 S17.2 | 69.38,12.55 69.34,12.6 66.66,12.6 65.85,11.79 64.78,11.79 S17.1 | S18.1 64.78,22.7 66.21,22.7 66.3,22.61 66.48,22.61 66.83,22.25 69.16,22.25 69.51,22.61 69.69,22.61 69.78,22.7 71.21,22.7 S18.2 | 69.38,12.55 69.42,12.6 69.42,13.58 73.45,17.6 73.45,19.93 71.3,22.07 71.3,22.7 S18.2 | S19.2 71.3,33.69 71.3,31.99 73.45,29.84 73.45,25.55 71.3,23.41 71.3,22.78 S18.2 | S20.1 64.78,44.67 66.21,44.67 66.3,44.59 69.6,44.59 69.69,44.67 71.21,44.67 S20.2 71.3,44.67 71.3,44.05 73.45,41.91 73.45,39.58 71.3,37.44 71.3,33.77 S19.2
  Bottom 0.152: D5.A 64.35,45.16 S20.1
N$1  (via drill 0.35)
  Top 0.152: v54.77,56.02 54.77,53.52 LED1.A
  Bottom 0.152: v54.77,56.02 54.77,56.83 54.5,57.09 R2.2
N$2
  Top 0.152: U$2.26 6.79,89.89 7.5,89.89 8.04,90.42 8.04,90.87 9.56,92.39 70.41,92.39 72.91,89.89 73.18,89.89 U$3.14
N$3  (via drill 0.35)
  Top 0.152: v54.15,75.14 53.7,75.59 52.63,75.59 U1.7
  Bottom 0.152: v54.15,75.14 55.13,74.16 57.45,74.16 R7.1
N$4  (via drill 0.35)
  Top 0.152: IC1.10 26.62,68.98 v26.72,69.07
  Bottom 0.152: v26.72,69.07 27.07,69.42 27.07,71.12 R8.1
N$5  (via drill 0.35)
  Top 0.152: U1.3 46.37,74.36 v45,73
  Bottom 0.152: v45,73 47.5,75.5 R5.1
N$6
  Top 0.152: LED2.P$4 25.29,52.98 25.29,52.36 25.64,52 26.8,52 27.25,51.55 27.25,48.43 26.8,47.98 23.41,47.98 22.34,49.05 21.62,49.05 21.53,49.14 R4.2
N$7
  Top 0.152: LED2.P$1 26.8,53.97 27.61,53.97 28.59,52.98 28.59,50.48 28.77,50.3 28.77,49.59 29.13,49.23 29.93,49.23 R9.2
N$8
  Top 0.152: LED2.P$2 25.2,53.97 24.39,53.97 24.12,53.7 24.12,52 25.11,51.02 25.82,51.02 25.91,50.93 R10.2
N$9  (via drill 0.35)
  Top 0.152: v21.89,52.27 21.53,51.91 21.53,50.93 R4.1 | IC1.15 23.38,66.62 v23.14,66.39
  Bottom 0.152: v21.89,52.27 21.89,65.14 v23.14,66.39
N$10  (via drill 0.35)
  Top 0.152: v23.41,53.79 23.41,51.02 25.2,49.23 25.91,49.23 R10.1 | IC1.1 22.73,61.06 v22.61,60.94
  Bottom 0.152: v23.41,53.79 23.41,59.15 22.61,59.95 v22.61,60.94
N$11  (via drill 0.35)
  Top 0.152: v29.31,52.54 29.93,51.91 29.93,50.93 R9.1 | IC1.2 23.38,60.28 v23.32,60.22
  Bottom 0.152: v29.31,52.54 29.31,54.23 v23.32,60.22
N$12
  Bottom 0.152: R12.1 7.5,68.17 9.02,68.17 9.11,68.08 10.28,68.08 JP1.14
N$13  (via drill 0.35)
  Top 0.152: IC1.3 24.02,57.52 v15.5,49
  Bottom 0.152: v15.5,49 15.5,48.65 D1.C
N$14  (via drill 0.35)
  Top 0.152: IC1.4 24.68,61.66 32,54.34 v32,49
  Bottom 0.152: v32,49 32,47.65 D2.C
N$15  (via drill 0.35)
  Top 0.152: IC1.5 25.32,61.67 25.52,61.48 25.52,61.47 35.5,51.49 v35.5,50
  Bottom 0.152: v35.5,50 35.5,49.15 D3.C
N$16  (via drill 0.35)
  Top 0.152: IC1.6 26,62.27 26,61.49 35.49,52 v37,52
  Bottom 0.152: v37,52 37.15,51.85 D4.C
N$17  (via drill 0.35)
  Top 0.152: IC1.7 26.62,61.38 34,54 v41.5,54
  Bottom 0.152: v41.5,54 47.5,48 D5.C
OSC  (via drill 0.35)
  Top 0.152: v31.18,91.67 11.44,91.67 10.54,90.78 10.54,90.33 10.1,89.89 9.38,89.89 U$2.25
  Bottom 0.152: v31.18,91.67 43.24,91.67 45.03,89.89 45.21,89.89 U$3.25
REG_LATCH
  Top 0.152: IC1.12 25.32,66.67 27.05,64.95 27.55,64.95 27.73,64.78 37.67,64.78 U$1.20
RESET
  Bottom 0.152: R1.2 12.87,86.58 12.87,87.83 11.88,88.81 11.88,89.8 U$2.24 11.88,89.89 11.97,89.97 12.69,89.97 15.1,92.39 45.03,92.39 46.55,90.87 46.55,90.42 47.09,89.89 47.8,89.89 U$3.24
RS
  Top 0.152: 34.76,89.8 U$2.15 40.01,84.5 40.43,84.08 | U$3.15 70.68,89.8 69.87,89.8 64.15,84.08 41.5,84.08 41.46,84.08 40.43,84.08 | U$1.11 40.75,83.76 40.43,84.08
RST
  Top 0.152: U$1.4 42.35,64.24 42.62,64.24 42.8,64.42 55.04,64.42 63.62,55.84 64.69,55.84 S21.1 64.78,55.84 65.85,55.84 66.66,56.65 69.34,56.65 70.14,55.84 71.21,55.84 S21.2
RX  (via drill 0.35)
  Top 0.152: v31.63,63.35 32.97,62.01 37.97,62.01 38.15,62.19 38.24,62.19 U$1.25 | v16.35,68.17 14.12,68.17 14.03,68.08 12.87,68.08 JP1.13
  Bottom 0.152: v31.63,63.35 30.56,64.42 30.11,64.42 26.36,68.17 v16.35,68.17
SEL
  Bottom 0.152: R3.2 20.37,86.58 20.37,87.92 19.48,88.81 19.48,89.8 U$2.21
SRAM_CS
  Top 0.152: U$1.8 42.35,66.3 42.44,66.39 42.44,66.57 46.82,70.94 47.62,70.94 49.23,72.55 49.23,76.22 48.61,76.84 47.53,76.84 U1.1
SRAM_SCK  (via drill 0.35)
  Top 0.152: v46.55,71.57 41.82,66.83 U$1.9 | v50.93,73.89 51.38,74.34 52.54,74.34 U1.6
  Bottom 0.152: v46.55,71.57 48.61,71.57 v50.93,73.89
SRAM_SI  (via drill 0.35)
  Top 0.152: v50.93,72.91 51.11,73.09 52.54,73.09 U1.5 | U$1.17 37.25,66.25 36.85,66.65 v36.85,67.51
  Bottom 0.152: v50.93,72.91 47.01,68.99 | 47.01,68.99 46.53,68.51 | 47.01,68.99 38.88,68.99 37.41,67.51 v36.85,67.51
SRAM_SO
  Top 0.152: U1.2 47.45,75.59 46.28,75.59 41.25,70.56 U$1.10
TCK  (via drill 0.35)
  Top 0.152: v40.83,61.2 41.01,61.2 41.1,61.29 40.74,61.65 40.74,62.19 U$1.30 | v22.61,64.42 21.53,64.42 21.36,64.24 20.64,64.24 20.55,64.15 R11.2 20.46,64.15 13.76,64.15 13.67,64.06 12.42,64.06 11.79,63.44 11.79,62.46 11.62,62.28 11.62,61.74 10.37,60.49 JP1.8 10.28,60.4 6.17,56.29 6.17,21.44 8.67,18.94 8.67,18.32 S2.3 8.76,18.23 10.19,18.23 10.37,18.05 10.54,18.05 10.81,17.78 13.22,17.78 13.49,18.05 13.58,18.05 13.76,18.23 15.19,18.23 S2.4 15.28,18.23 16.71,18.23 16.89,18.05 17.07,18.05 17.33,17.78 20.64,17.78 20.91,18.05 21.09,18.05 21.27,18.23 22.7,18.23 S6.3 22.78,18.32 23.86,18.32 24.66,19.12 27.34,19.12 28.14,18.32 29.22,18.32 S6.4 29.31,18.32 30.38,18.32 31.18,19.12 34.85,19.12 35.38,18.59 36.45,18.59 36.72,18.32 S10.3 36.81,18.23 38.24,18.23 38.42,18.05 38.6,18.05 38.87,17.78 41.19,17.78 41.46,18.05 41.73,18.05 41.91,18.23 43.24,18.23 S10.4 43.34,18.32 44.32,18.32 45.12,19.12 48.87,19.12 49.68,18.32 50.66,18.32 S14.3 50.75,18.23 51.73,18.23 52.63,17.33 55.4,17.33 56.29,18.23 57.18,18.23 S14.4 57.27,18.32 57.54,18.59 58.61,18.59 59.15,19.12 62.81,19.12 63.62,18.32 64.69,18.32 S18.3 64.78,18.32 65.85,18.32 66.66,19.12 69.34,19.12 70.14,18.32 71.21,18.32 S18.4
  Bottom 0.152: v40.83,61.2 25.82,61.2 v22.61,64.42
TDI
  Top 0.152: JP1.6 10.28,57.9 6.52,54.15 6.52,32.17 8.76,29.93 8.76,29.31 S3.3 8.76,29.22 10.19,29.22 10.37,29.04 10.54,29.04 10.81,28.77 13.13,28.77 13.4,29.04 13.58,29.04 13.76,29.22 15.19,29.22 S3.4 15.28,29.31 16.35,29.31 17.16,30.11 20.82,30.11 21.62,29.31 22.7,29.31 S7.3 22.78,29.31 23.86,29.31 24.66,30.11 27.34,30.11 28.14,29.31 29.22,29.31 S7.4 29.31,29.31 30.38,29.31 33.15,32.08 34.49,32.08 34.53,32.12 | S19.4 71.21,29.31 70.14,29.31 69.34,30.11 66.66,30.11 65.85,29.31 64.78,29.31 S19.3 64.69,29.22 63.26,29.22 63.08,29.04 62.9,29.04 62.63,28.77 59.33,28.77 59.06,29.04 58.79,29.04 58.61,29.22 57.27,29.22 S15.4 57.18,29.22 57.01,29.04 55.49,29.04 55.22,28.77 52.81,28.77 52.54,29.04 52.36,29.04 52.18,29.22 50.75,29.22 S15.3 50.66,29.22 49.32,29.22 49.14,29.04 48.96,29.04 48.7,28.77 45.3,28.77 45.03,29.04 44.76,29.04 44.59,29.22 43.34,29.22 S11.4 43.24,29.22 41.82,29.22 41.64,29.04 41.46,29.04 41.19,28.77 38.87,28.77 38.6,29.04 38.42,29.04 38.24,29.22 36.81,29.22 S11.3 36.72,29.31 36.72,29.93 34.53,32.12 | 34.53,32.12 34.49,32.17 34.49,40.83 35.38,41.73 36.9,41.73 42.44,47.27 42.44,61.56 41.82,62.19 U$1.32
TDO
  Top 0.152: S8.4 29.22,40.21 28.14,40.21 27.34,39.4 24.66,39.4 23.86,40.21 22.78,40.21 S8.3 22.7,40.3 21.62,40.3 20.82,41.1 17.16,41.1 16.35,40.3 15.28,40.3 S4.4 15.19,40.3 14.12,40.3 13.31,41.1 10.99,41.1 | 10.99,41.1 10.63,41.1 9.83,40.3 8.76,40.3 S4.3 | 10.99,41.1 10.99,45.3 8.94,47.35 8.94,53.97 10.28,55.31 JP1.4 | S20.4 71.21,40.21 69.78,40.21 69.6,40.03 69.42,40.03 69.16,39.76 66.83,39.76 66.57,40.03 66.39,40.03 66.21,40.21 64.78,40.21 S20.3 64.69,40.3 63.62,40.3 62.81,41.1 59.15,41.1 58.35,40.3 57.27,40.3 S16.4 57.18,40.21 57.01,40.03 55.4,40.03 55.13,39.76 52.81,39.76 52.54,40.03 52.36,40.03 52.18,40.21 50.75,40.21 S16.3 50.66,40.21 49.23,40.21 49.05,40.03 48.96,40.03 48.7,39.76 45.3,39.76 45.03,40.03 44.76,40.03 44.59,40.21 43.34,40.21 S12.4 43.24,40.3 43.24,40.92 41.06,43.11 | 41.06,43.11 41.01,43.16 41.01,45.3 42.98,47.27 42.98,62.1 42.35,62.72 U$1.1 | S12.3 36.81,40.3 37.88,40.3 40.65,43.07 41.01,43.07 41.06,43.11
  Bottom 0.152: S8.4 29.31,40.3 30.38,40.3 31.18,41.1 34.85,41.1 35.65,40.3 36.72,40.3 S12.3
TMS  (via drill 0.35)
  Top 0.152: v34.04,55.13 39.96,61.04 40.12,61.2 40.17,61.26 40.17,61.48 40.25,61.55 U$1.29 | S1.3 8.76,7.33 10.28,7.33 10.37,7.42 10.72,7.42 10.99,7.68 13.22,7.68 13.49,7.42 13.58,7.42 13.76,7.24 15.19,7.24 S1.4 15.28,7.24 16.71,7.24 16.89,7.06 21.09,7.06 21.27,7.24 22.7,7.24 S5.3 22.78,7.33 24.3,7.33 24.39,7.42 27.7,7.42 27.79,7.33 29.22,7.33 S5.4 29.31,7.24 30.74,7.24 30.91,7.42 31.09,7.42 31.36,7.68 34.67,7.68 34.94,7.42 35.2,7.42 35.29,7.33 36.72,7.33 S9.3 36.81,7.24 38.24,7.24 38.42,7.42 38.6,7.42 38.87,7.68 41.19,7.68 41.46,7.42 41.73,7.42 41.82,7.33 43.24,7.33 S9.4 43.34,7.33 44.32,7.33 45.12,8.13 48.87,8.13 49.68,7.33 50.66,7.33 S13.3 50.75,7.33 51.82,7.33 52.63,8.13 55.4,8.13 56.2,7.33 57.18,7.33 S13.4 57.27,7.24 58.61,7.24 58.79,7.06 59.06,7.06 59.33,6.79 62.63,6.79 62.9,7.06 63.08,7.06 63.26,7.24 64.69,7.24 S17.3 64.78,7.24 66.21,7.24 66.39,7.06 69.6,7.06 69.78,7.24 71.21,7.24 S17.4
  Bottom 0.152: v34.04,55.13 33.42,55.13 29.48,51.2 20.55,51.2 | 20.55,51.2 19.03,51.2 13.4,56.83 12.42,56.83 11.79,57.45 11.79,58.52 11.53,58.79 11.53,59.77 11.44,59.86 11.44,61.2 11.53,61.29 11.53,61.74 10.28,62.99 JP1.10 | 20.55,51.2 20.55,10.1 22.7,7.95 22.7,7.33 S5.3
TX  (via drill 0.35)
  Top 0.152: v30.29,63.71 30.65,64.06 35.5,64.06 35.83,64.06 35.94,64.06 36.75,63.25 U$1.23
  Bottom 0.152: v30.29,63.71 26.54,67.46 16.08,67.46 12.87,70.68 JP1.15
VCC  (via drill 0.35)
  Top 0.203: v29.48,85.15 29.48,84.08 29.13,83.72 | 29.13,83.72 29.13,83.54 29.57,83.1 29.57,82.2 U$2.10 | 23.23,83.72 29.13,83.72 | 23.23,83.72 17.16,89.8 16.98,89.8 U$2.22 | U$3.3 47.89,82.11 47.89,81.58 52.54,76.93 U1.8 52.63,76.93 53.79,78.09 v54.5,78.09 | 22.7,67.73 IC1.16 22.73,69.22 23.05,69.55 v23.05,70.05 23.05,70.14 23.23,70.32 23.23,83.72 | U$1.6 42.35,65.31 42.35,65.67 U$1.7 42.44,65.67 42.53,65.76 42.71,65.76 v43.24,66.3 | v41.73,58.44 41.73,61.29 41.25,61.77 U$1.31 | v43.24,62.81 43.16,62.81 42.71,63.26 42.35,63.26 U$1.2 | v27.97,50.22 27.97,51.47 26.8,52.63 26.8,52.98 LED2.P$3 | U$1.15 38.75,67.53 v38.59,67.68 | U$1.19 37.42,65.25 36.79,65.25 v36.54,65.49 36.8,65.75 U$1.18 | U$1.24 36.16,62.75 v35.56,63.35
  Bottom 0.203: v29.48,85.15 29.48,86.49 C8.1 | C7.1 16.89,86.58 18.59,86.58 R3.1 | C7.1 17.16,86.67 17.16,88.72 16.98,88.9 16.98,89.8 U$2.22 | U$2.3 11.79,82.11 11.79,81.49 7.5,77.2 7.5,69.87 R12.2 7.42,69.87 6.97,69.87 6.25,69.16 6.25,56.92 10.28,52.9 JP1.2 JP1.1 | R1.1 11.17,86.49 11.17,83.72 11.79,83.1 11.79,82.2 U$2.3 | C7.1 16.89,86.4 16.89,85.86 14.47,83.45 13.76,83.45 12.69,82.38 11.88,82.38 U$2.3 | U$3.22 52.98,89.8 52.98,88.9 53.16,88.72 53.16,86.58 C9.1 53.07,86.49 52.45,86.49 48.16,82.2 47.89,82.2 U$3.3 | C5.1 63.88,70.94 IC2.2 63.98,71.03 70.05,71.03 IC2.4 | 53.43,78.45 54.23,78.45 54.55,78.14 | 54.55,78.14 56.65,76.04 57.27,76.04 57.45,75.86 R7.2 57.54,75.86 57.72,76.04 58.61,76.04 | 53.43,78.45 C10.1 | 58.61,76.04 64.69,82.11 65.58,82.11 U$3.10 | C5.1 59.51,71.03 59.51,75.05 58.61,75.95 58.61,76.04 | v54.5,78.09 54.55,78.14 | v23.05,70.05 23.32,70.32 23.32,71.03 23.41,71.12 C11.1 23.59,71.21 24.66,71.21 26.18,72.73 26.89,72.73 26.98,72.82 R8.2 27.07,72.82 27.7,72.82 32.61,67.91 32.61,65.76 32.79,65.58 C4.1 32.88,65.49 32.97,65.4 33.69,65.4 35.07,64.02 | v35.56,63.35 35.56,63.53 35.07,64.02 | 35.07,64.02 v36.54,65.49 36.54,66.11 37.26,66.83 | 43.96,63.62 43.96,65.58 v43.24,66.3 41.86,67.68 v38.59,67.68 38.12,67.68 37.26,66.83 | 43.96,63.62 43.24,62.9 v43.24,62.81 43.24,60.04 41.73,58.52 v41.73,58.44 41.73,57.54 41.55,57.36 C1.1 41.46,57.27 41.37,57.18 40.74,57.18 33.77,50.22 v27.97,50.22 | 43.96,63.62 44.05,63.62 44.67,62.99 48.61,62.99 C2.1 48.52,62.9 48.52,62.55 50.26,60.8 | 50.26,60.8 52.18,58.88 54.41,58.88 R2.1 | 50.26,60.8 51.64,62.19 51.64,63.8 58.79,70.94 59.42,70.94 C5.1
  Bottom 0.203: C3.1 36.52,66.83 37.26,66.83 | R5.2 51.35,76.5 52,76.5 53.43,77.93 53.43,78.45

### Text on the board
Top: (c) www.pdaXrom.org 2021 / microcpu computer v1.0
tPlace: GND GND | JTEN TX | RX | GND GND | TMS GPIO3 | TCK GPIO2 | TDI GPIO1 | RESET | TDO GPIO0 | VCC VCC | 7 | 8 | 9 | C | MEM | 4 | 5 | 6 | D | PREV | 1 | 2 | 3 | E | NEXT | 0 | A | B | F | ENTER